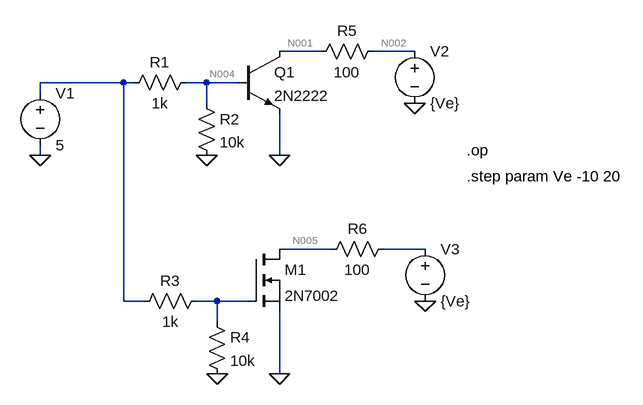
[diagram p0: schematic Draft1.asc]
Draft1.asc, the LTspice schematic file:
Version 4
SHEET 1 880 680
WIRE 368 64 304 64
WIRE 512 64 448 64
WIRE 64 112 -64 112
WIRE 80 112 64 112
WIRE 192 112 160 112
WIRE 240 112 192 112
WIRE -64 128 -64 112
WIRE 192 144 192 112
WIRE -64 224 -64 208
WIRE 304 224 304 160
WIRE 384 368 304 368
WIRE 528 368 464 368
WIRE 64 448 64 112
WIRE 96 448 64 448
WIRE 208 448 176 448
WIRE 256 448 208 448
WIRE 208 480 208 448
WIRE 304 560 304 464
FLAG -64 224 0
FLAG 192 224 0
FLAG 208 560 0
FLAG 304 224 0
FLAG 304 560 0
FLAG 528 448 0
FLAG 512 144 0
SYMBOL voltage -64 112 R0
WINDOW 123 0 0 Left 0
WINDOW 39 0 0 Left 0
SYMATTR InstName V1
SYMATTR Value 5
SYMBOL npn 240 64 R0
SYMATTR InstName Q1
SYMATTR Value 2N2222
SYMBOL nmos 256 368 R0
SYMATTR InstName M1
SYMATTR Value 2N7002
SYMBOL res 176 96 R90
WINDOW 0 0 56 VBottom 2
WINDOW 3 32 56 VTop 2
SYMATTR InstName R1
SYMATTR Value 1k
SYMBOL res 176 128 R0
SYMATTR InstName R2
SYMATTR Value 10k
SYMBOL res 192 432 R90
WINDOW 0 0 56 VBottom 2
WINDOW 3 32 56 VTop 2
SYMATTR InstName R3
SYMATTR Value 1k
SYMBOL res 192 464 R0
SYMATTR InstName R4
SYMATTR Value 10k
SYMBOL voltage 512 48 R0
WINDOW 123 0 0 Left 0
WINDOW 39 0 0 Left 0
SYMATTR InstName V2
SYMATTR Value {Ve}
SYMBOL voltage 528 352 R0
WINDOW 123 0 0 Left 0
WINDOW 39 0 0 Left 0
SYMATTR InstName V3
SYMATTR Value {Ve}
SYMBOL res 464 48 R90
WINDOW 0 0 56 VBottom 2
WINDOW 3 32 56 VTop 2
SYMATTR InstName R5
SYMATTR Value 100
SYMBOL res 480 352 R90
WINDOW 0 0 56 VBottom 2
WINDOW 3 32 56 VTop 2
SYMATTR InstName R6
SYMATTR Value 100
TEXT 592 216 Left 2 !.op
TEXT 592 256 Left 2 !.step param Ve -10 20

The netlist it stands for:
* Draft1.asc
V1 N003 0 5
Q1 N001 N004 0 0 2N2222
M1 N005 N007 0 0 2N7002
R1 N004 N003 1k
R2 N004 0 10k
R3 N007 N003 1k
R4 N007 0 10k
V2 N002 0 {Ve}
V3 N006 0 {Ve}
R5 N002 N001 100
R6 N006 N005 100
.model NPN NPN
.model PNP PNP
.lib standard.bjt
.model NMOS NMOS
.model PMOS PMOS
.lib standard.mos
.op
.step param Ve -10 20
.backanno
.end

* Results of the author's LTspice run, read from the files saved beside the schematic
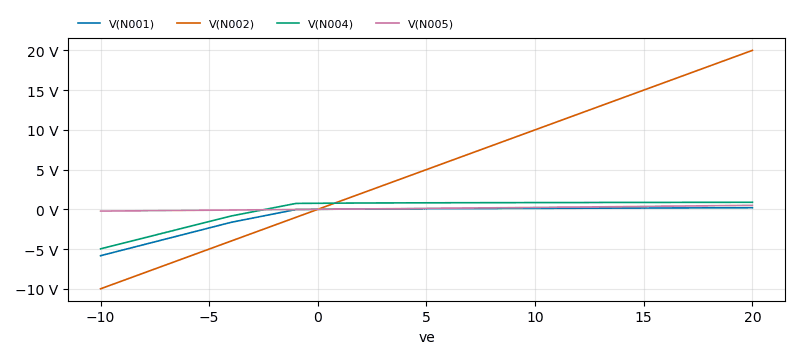
[diagram p1: Operating Point of Draft1.asc, plotted from the saved traces]
* Operating Point, 1 run:
*   V(N001): -5.835 V at ve=-10 , 201.2 mV at ve=20 , min -5.835 V, max 201.2 mV
*   V(N002): -10 V at ve=-10 , 20 V at ve=20 , min -10 V, max 20 V
*   V(N004): -4.974 V at ve=-10 , 887 mV at ve=20 , min -4.974 V, max 887 mV
*   V(N005): -223 mV at ve=-10 , 502.3 mV at ve=20 , min -223 mV, max 502.3 mV
* From the log:
*   Semiconductor Device Operating Points:
*                           --- Bipolar Transistors ---
*   Name:       q1
*   Model:    2n2222
*   Ib:       1.05e-02
*   Ic:      -4.16e-02
*   Vbe:     -4.97e+00
*   Vbc:      8.61e-01
*   Vce:     -5.84e+00
*   BetaDC:  -3.98e+00
*   Gm:      -1.21e+00
*   Rpi:      1.00e+12
*   Rx:       1.00e+01
*   Ro:       8.30e-01
*   Cbe:      1.27e-11
*   Cbc:      1.21e-07
*   Cjs:      0.00e+00
*   BetaAC:  -1.21e+12
*   Cbx:      0.00e+00
*   Ft:       1.58e+06
*                           --- VDMOSFET Transistors ---
*   Name:          m1
*   Model:       2n7002
*   Id:         -9.78e-02
*   Vgs:         4.55e+00
*   Vds:        -2.23e-01
*   Vth:         1.60e+00
*   Gm:          3.18e-02
*   Gds:         6.34e-01
*   Cgs:         5.00e-11
*   Cgd:         8.00e-11
*   Cbody:       5.67e-11